# EAGLE design main_board (EAGLE 9.6.2)
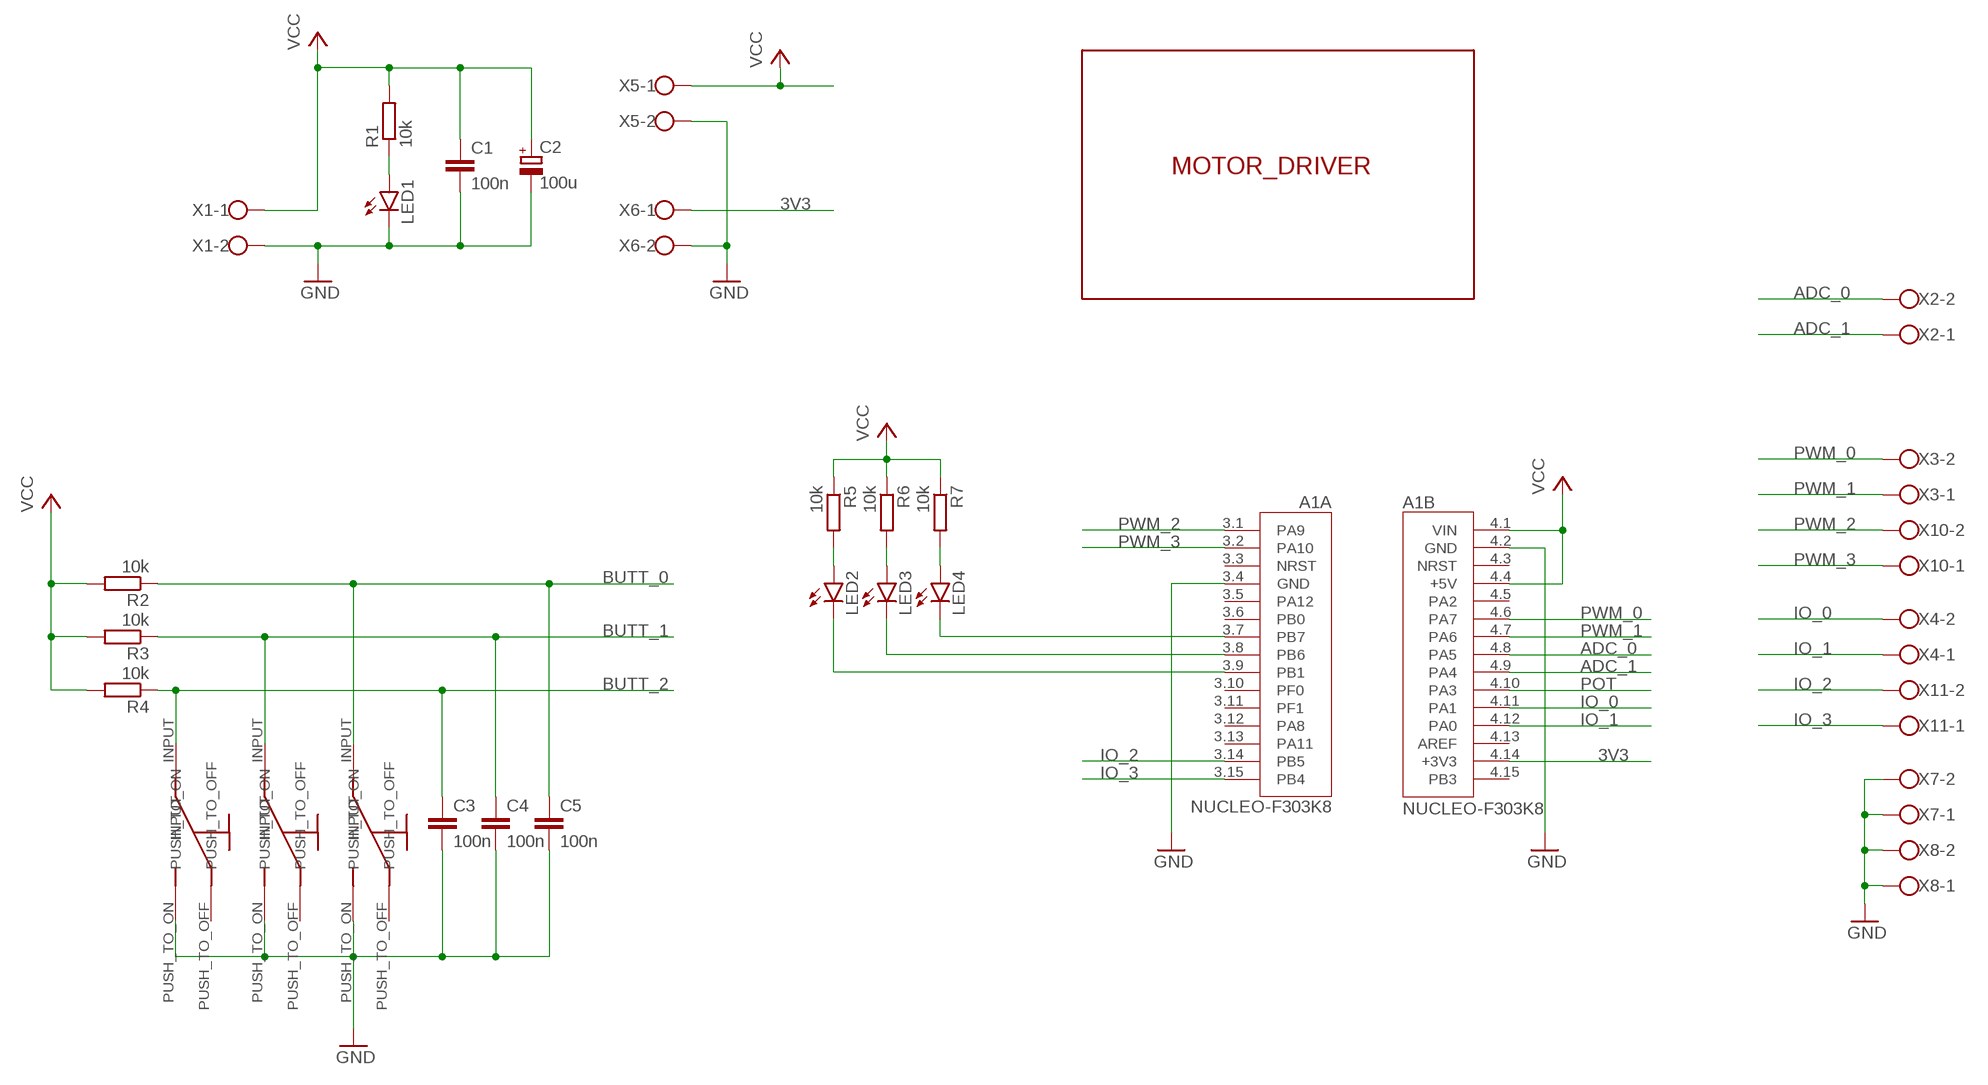
[diagram p0: schematic, sheet 1]

## Parts
A1  NUCLEO-F303K8  [MODULE_NUCLEO-F303K8]
C1  100n  C-EUC1206  [C1206]
C2  100u  CPOL-EU150CLZ-1010  [150CLZ-1010]
C3  100n  C-EUC1206  [C1206]
C4  100n  C-EUC1206  [C1206]
C5  100n  C-EUC1206  [C1206]
LED1  LEDSMT1206  [1206]
LED2  LEDCHIPLED_1206  [CHIPLED_1206]
LED3  LEDCHIPLED_1206  [CHIPLED_1206]
LED4  LEDCHIPLED_1206  [CHIPLED_1206]
R1  10k  R-EU_R1206  [R1206]
R2  10k  R-EU_R1206  [R1206]
R3  10k  R-EU_R1206  [R1206]
R4  10k  R-EU_R1206  [R1206]
R5  10k  R-EU_R1206  [R1206]
R6  10k  R-EU_R1206  [R1206]
R7  10k  R-EU_R1206  [R1206]
U$2  BUTTON  [BUTTON]
U$3  BUTTON  [BUTTON]
U$4  BUTTON  [BUTTON]
U$5  MOTOR_DRIVER  [MOTOR_DRIVER]
X1  W237-102  [W237-102]
X2  W237-102  [W237-102]
X3  W237-102  [W237-102]
X4  W237-102  [W237-102]
X5  W237-102  [W237-102]
X6  W237-102  [W237-102]
X7  W237-102  [W237-102]
X8  W237-102  [W237-102]
X10  W237-102  [W237-102]
X11  W237-102  [W237-102]

## Nets
3V3: A1.4.14(B:+3V3) X6.1
ADC_0: A1.4.8(B:PA5) X2.2
ADC_1: A1.4.9(B:PA4) X2.1
BUTT_0: C5.1 R2.1 U$4.INPUT
BUTT_1: C4.1 R3.1 U$2.INPUT
BUTT_2: C3.1 R4.1 U$3.INPUT
GND: A1.3.4(A:GND) A1.4.2(B:GND) C1.2 C2.- C3.2 C4.2 C5.2 LED1.C U$2.PUSH_TO_ON U$3.PUSH_TO_ON U$4.PUSH_TO_ON X1.2 X5.2 X6.2 X7.1 X7.2 X8.1 X8.2
IO_0: A1.4.11(B:PA1) X4.2
IO_1: A1.4.12(B:PA0) X4.1
IO_2: A1.3.14(A:PB5) X11.2
IO_3: A1.3.15(A:PB4) X11.1
N$2: A1.3.9(A:PB1) LED2.C
N$3: A1.3.8(A:PB6) LED3.C
N$4: A1.3.7(A:PB7) LED4.C
N$8: LED1.A R1.1
N$11: LED4.A R7.2
N$12: LED3.A R6.2
N$13: LED2.A R5.2
POT: A1.4.10(B:PA3)
PWM_0: A1.4.6(B:PA7) X3.2
PWM_1: A1.4.7(B:PA6) X3.1
PWM_2: A1.3.1(A:PA9) X10.2
PWM_3: A1.3.2(A:PA10) X10.1
VCC: A1.4.1(B:VIN) A1.4.4(B:+5V) C1.1 C2.+ R1.2 R2.2 R3.2 R4.2 R5.1 R6.1 R7.1 X1.1 X5.1
Unconnected: A1.3.3(A:NRST) A1.3.5(A:PA12) A1.3.6(A:PB0) A1.3.10(A:PF0) A1.3.11(A:PF1) A1.3.12(A:PA8) A1.3.13(A:PA11) A1.4.3(B:NRST) A1.4.5(B:PA2) A1.4.13(B:AREF) A1.4.15(B:PB3) U$2.PUSH_TO_OFF U$3.PUSH_TO_OFF U$4.PUSH_TO_OFF

## Library data of the parts
A1 = NUCLEO-F303K8:NUCLEO-F303K8: STM32 Nucleo-32 development board with STM32F303K8T6 MCU, supports Arduino connectivity; AVAILABILITY: Unavailable; DESCRIPTION: STM32F303K8, mbed-Enabled Development Nucleo-32 STM32F3 ARM® Cortex®-M4 MCU 32-Bit Embedded Evaluation Board; MF: STMicroelectronics; MP: NUCLEO-F303K8; PACKAGE: None; PRICE: None
C1 C3-C5 = rcl:C-EU: CAPACITOR, European symbol; SPICEPREFIX: C
C2 = rcl:CPOL-EU: POLARIZED CAPACITOR, European symbol; SPICEPREFIX: C
LED1-LED4 = led:LED: LED OSRAM: - CHIPLED LG R971, LG N971, LY N971, LG Q971, LY Q971, LO R971, LY R971 LH N974, LH R974 LS Q976, LO Q976, LY Q976 LO Q996 - Hyper CHIPLED LW Q18S LB Q993, LB Q99A, LB R99A - SideLED LS A670, LO A670, LY A670, LG A670, LP A670 LB A673, LV A673, LT A673, LW A673 LH A674 LY A675 LS A676, LA A676, LO A676, LY A676, LW A676 LS A679, LY A679, LG A679 - Hyper Micro SIDELED® LS Y876, LA Y876, LO Y876, LY Y876 LT Y87S - SmartLED LW L88C, LW L88S LB L89C, LB L89S, LG L890 LS L89K, LO L89K, LY L89K LS L896, LA L896, LO L896, LY L896 - TOPLED LS T670, LO T670, LY T670, LG T670, LP T670 LSG T670, LSP T670, LSY T670, LOP T670, LYG T670 LG T671, LOG T671, LSG T671 LB T673, LV T673, LT T673, LW T673 LH T674 LS T676, LA T676, LO T676, LY T676, LB T676, LH T676, LSB T676, LW T676 LB T67C, LV T67C, LT T67C, LS T67K, LO T67K, LY T67K, LW E67C LS E67B, LA E67B, LO E67B, LY E67B, LB E67C, LV E67C, LT E67C LW T67C LS T679, LY T679, LG T679 LS T770, LO T770, LY T770, LG T770, LP T770 LB T773, LV T773, LT T773, LW T773 LH T774 LS E675, LA E675, LY E675, LS T675 LS T776, LA T776, LO T776, LY T776, LB T776 LHGB T686 LT T68C, LB T68C - Hyper Mini TOPLED® LB M676 - Mini TOPLED Santana® LG M470 LS M47K, LO M47K, LY M47K Source: http://www.osram.convergy.de LUXEON: - LUMILED® LXK2-PW12-R00, LXK2-PW12-S00, LXK2-PW14-U00, LXK2-PW14-V00 LXK2-PM12-R00, LXK2-PM12-S00, LXK2-PM14-U00 LXK2-PE12-Q00, LXK2-PE12-R00, LXK2-PE12-S00, LXK2-PE14-T00, LXK2-PE14-U00 LXK2-PB12-K00, LXK2-PB12-L00, LXK2-PB12-M00, LXK2-PB14-N00, LXK2-PB14-P00, LXK2-PB14-Q00 LXK2-PR12-L00, LXK2-PR12-M00, LXK2-PR14-Q00, LXK2-PR14-R00 LXK2-PD12-Q00, LXK2-PD12-R00, LXK2-PD12-S00 LXK2-PH12-R00, LXK2-PH12-S00 LXK2-PL12-P00, LXK2-PL12-Q00, LXK2-PL12-R00 Source: www.luxeon.com KINGBRIGHT: KA-3528ASYC Source: www.kingbright.com
R1-R7 = rcl:R-EU_: RESISTOR, European symbol; SPICEPREFIX: R
U$2-U$4 = gramofon:BUTTON
U$5 = gramofon:MOTOR_DRIVER
X1-X8 X10 X11 = con-wago-500:W237-102: WAGO SCREW CLAMP; MPN: 237-102; OC_FARNELL: unknown; OC_NEWARK: 70K9898

## Board
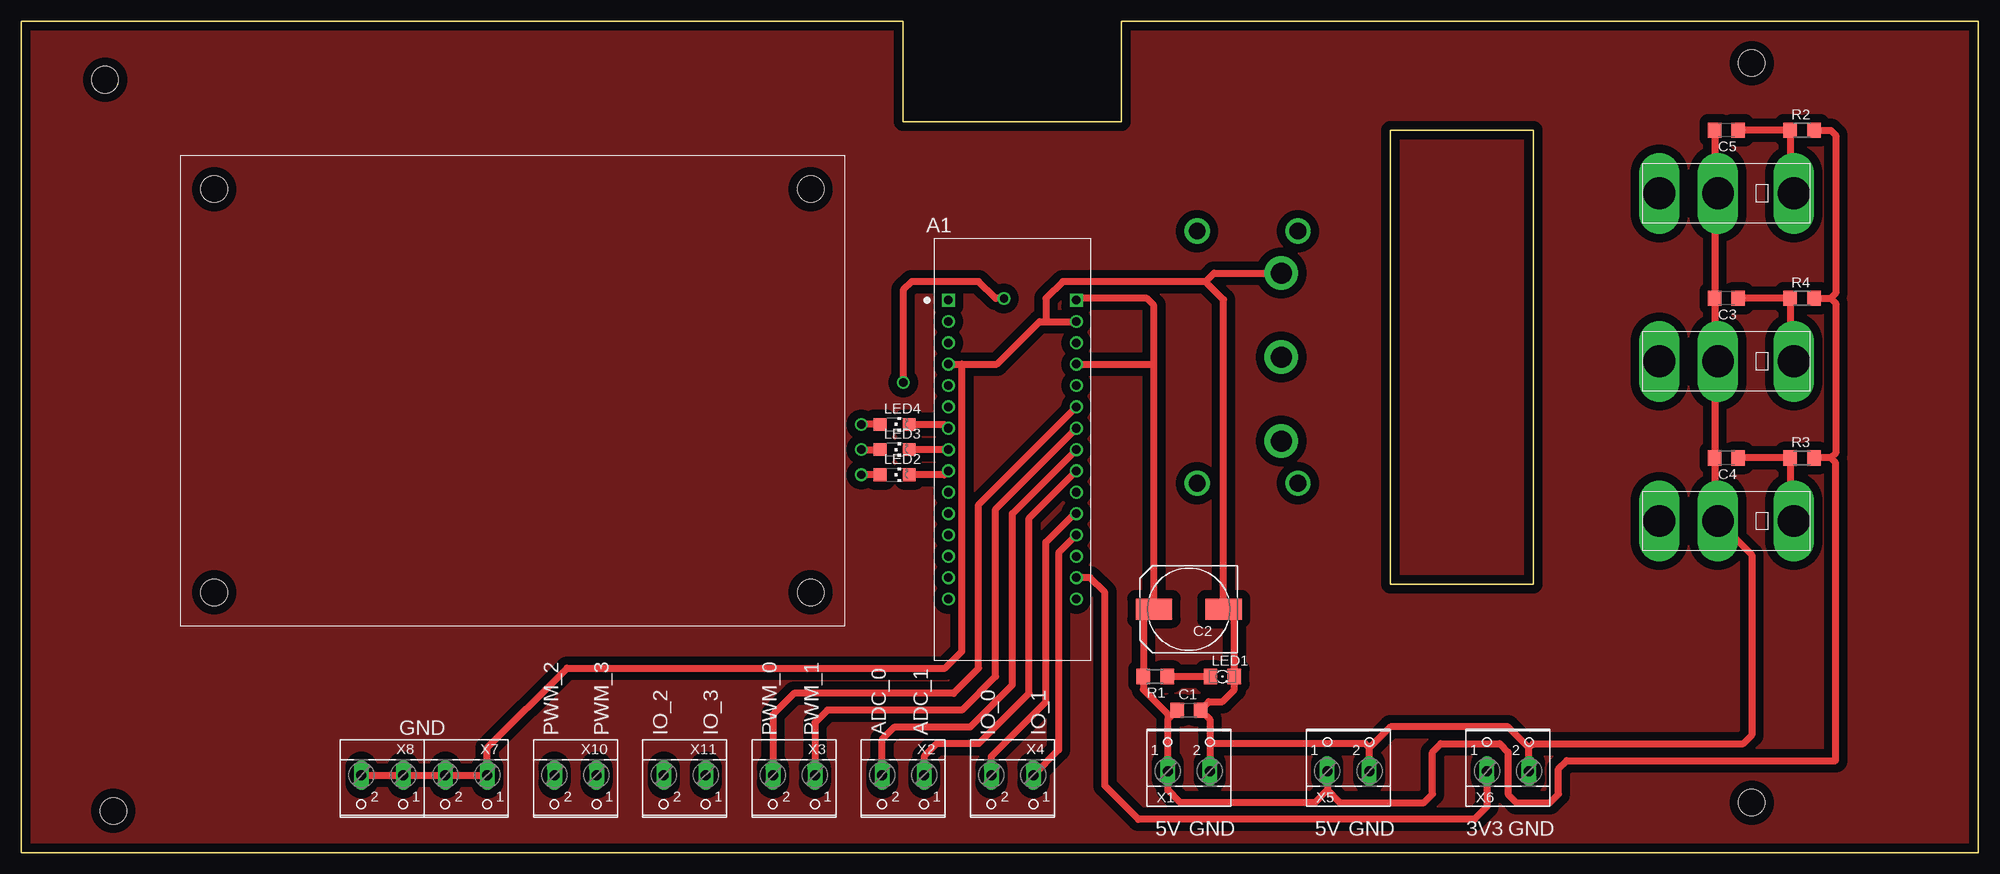
[diagram p1: board, top side]
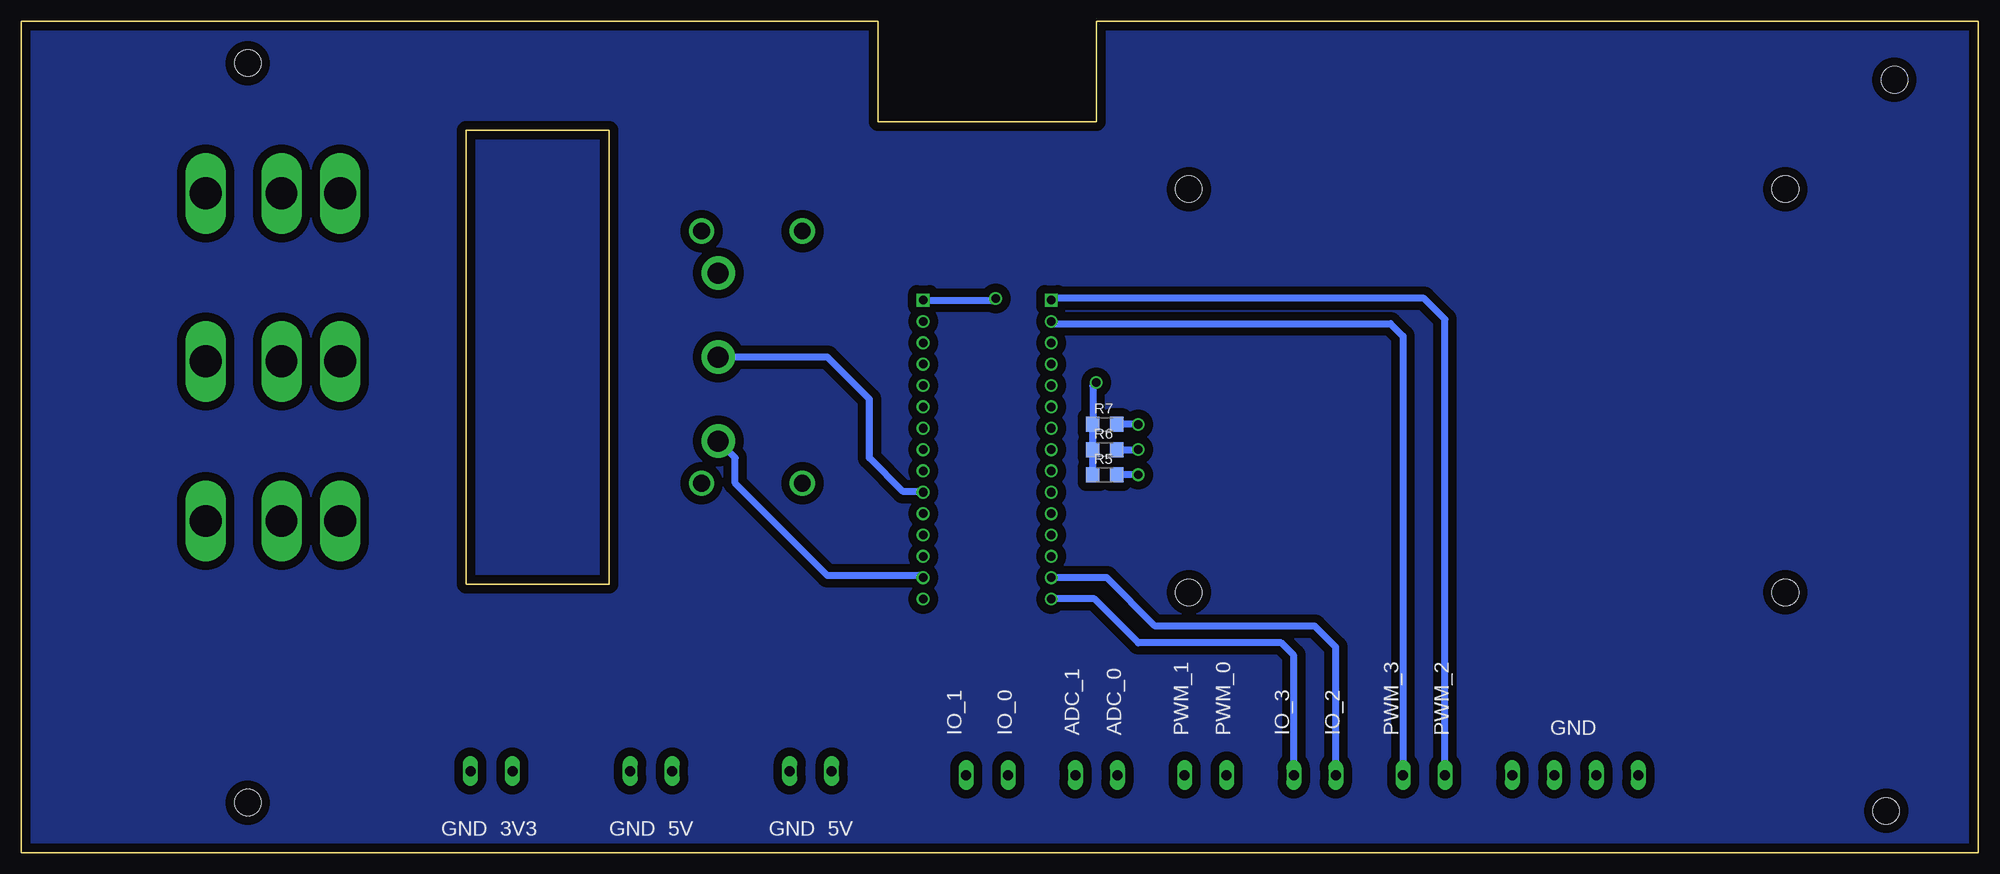
[diagram p2: board, bottom side, seen from below]

Size 233 x 99 mm. Coordinates in mm from the lower left corner, seen from the top.
Outline: 0,0 233,0 233,99 131,99 131,87 105,87 105,99 0,99 0,0
Outline: 180,86 180,32 163,32 163,86 180,86
Copper layers (1*16): Top 0.035mm / dielectric 1.5mm / Bottom 0.035mm
Design rules "default": minimum track width 6mil, minimum drill 0.35mm, track to track 6mil, track to pad 6mil, pad to pad 6mil, via to via 6mil, smd to smd 6mil, copper to edge 40mil, drill to drill 6mil, minimum pad ring 10mil, minimum via ring 8mil, stop-mask expansion 4mil, vias tented up to drill 0mil, thermal gap 10mil
Holes 3.2 mm at 206,94 206,6 11,5 10,92

### Footprints (pad centres in the part's own frame; a part is rotated, then mirrored left to right if it is on the bottom)
MODULE_NUCLEO-F303K8 = drill 1.02 square: 3.1 -7.62,17.78; 4.1 7.62,17.78 | drill 1.02: 3.2 -7.62,15.24; 3.3 -7.62,12.7; 3.4 -7.62,10.16; 3.5 -7.62,7.62; 3.6 -7.62,5.08; 3.7 -7.62,2.54; 3.8 -7.62,0; 3.9 -7.62,-2.54; 3.10 -7.62,-5.08; 3.11 -7.62,-7.62; 3.12 -7.62,-10.16; 3.13 -7.62,-12.7; 3.14 -7.62,-15.24; 3.15 -7.62,-17.78; 4.2 7.62,15.24; 4.3 7.62,12.7; 4.4 7.62,10.16; 4.5 7.62,7.62; 4.6 7.62,5.08; 4.7 7.62,2.54; 4.8 7.62,0; 4.9 7.62,-2.54; 4.10 7.62,-5.08; 4.11 7.62,-7.62; 4.12 7.62,-10.16; 4.13 7.62,-12.7; 4.14 7.62,-15.24; 4.15 7.62,-17.78
C1206 = smd 1.6 x 1.8: 1 -1.4,0; 2 1.4,0
150CLZ-1010 = smd 4.3 x 2.5: + 4.15,0; - -4.15,0
1206 = smd 1.6 x 1.803: A -1.422,0; C 1.422,0
CHIPLED_1206 = smd 1.5 x 1.5: A 0,-1.75; C 0,1.75
R1206 = smd 1.6 x 1.803: 1 -1.422,0; 2 1.422,0
BUTTON = drill 3.8 long: INPUT 3.5,18; PUSH_TO_OFF 3.5,2; PUSH_TO_ON 3.5,9
MOTOR_DRIVER = hole 3.2: 4,4; 52,4; 52,75; 4,75
W237-102 = drill 1.194 long: 1 -2.5,-1.27; 2 2.5,-1.27

### Placement (x,y rotation side)
A1  118,48 0 top
C1  139,17 0 top
C2  139,29 180 top
C3  203,66 180 top
C4  203,47 180 top
C5  203,86 180 top
LED1  143,21 0 top
LED2  104,45 270 top
LED3  104,48 270 top
LED4  104,51 270 top
R1  135,21 180 top
R2  212,86 0 top
R3  212,47 0 top
R4  212,66 0 top
R5  104,45 0 bottom
R6  104,48 0 bottom
R7  104,51 0 bottom
U$2  193,43 270 top
U$3  193,62 270 top
U$4  193,82 270 top
U$5  98,27 90 top
X1  139,11 0 top
X2  105,8 180 top
X3  92,8 180 top
X4  118,8 180 top
X5  158,11 0 top
X6  177,11 0 top
X7  53,8 180 top
X8  43,8 180 top
X10  66,8 180 top
X11  79,8 180 top

### Tracks (layer width: path | path; a pad name or v marks a point on that pad's centre or on a via)
3V3  (via drill 2.5 pad 4)
  Top 0.813: X6.1 174.5,5.5 173,4 133,4 129,8 129,31 127.24,32.76 A1.4.14
  Bottom 0.813: A1.4.14 125.86,33 137,33 148,44 148,47 v150,49
ADC_0
  Top 0.813: A1.4.8 118,40.38 118,20 113,15 104,15 102.5,13.5 X2.2
ADC_1
  Top 0.813: A1.4.9 120,39.84 120,19 114,13 109,13 107.5,11.5 X2.1
BUTT_0
  Top 0.813: C5.1 R2.1 210.58,78.92 U$4.INPUT
BUTT_1
  Top 0.813: C4.1 R3.1 210.58,39.92 U$2.INPUT
BUTT_2
  Top 0.813: C3.1 R4.1 210.58,58.92 U$3.INPUT
GND  (via drill 2.5 pad 4)
  Top 0.813: 141.5,13 141.5,15.9 C1.2 141.4,18 143,18 144.42,19.42 LED1.C 144.42,27.73 C2.- 143.15,65.85 141,68 | 141.5,13 X1.2 | X5.2 160.5,12.5 | 160.5,12.5 160,13 141.5,13 | X6.2 179.5,12.5 | 179.5,12.5 177,15 163,15 160.5,12.5 | C5.2 201.6,78.9 U$4.PUSH_TO_ON 201.6,78.1 C3.2 201.6,58.9 U$3.PUSH_TO_ON 201.6,58.1 C4.2 201.6,39.9 U$2.PUSH_TO_ON 206,35.5 206,14 205,13 180,13 179.5,12.5 | A1.3.4 112,58.16 | 112,58.16 116.16,58.16 121.24,63.24 122,63.24 | 122,63.24 A1.4.2 | 141,68 124,68 122,66 122,63.24 | X8.2 X8.1 X7.2 X7.1 55.5,12.5 65,22 110,22 112,24 112,58.16 | 141,68 142,69 v150,69
IO_0
  Top 0.813: X4.2 115.5,11.5 122,18 122,37 125.38,40.38 A1.4.11
IO_1
  Top 0.813: X4.1 123.5,12.27 123.5,35.72 A1.4.12
IO_2
  Bottom 0.813: X11.2 76.5,24.5 79,27 98,27 103.76,32.76 A1.3.14
IO_3
  Bottom 0.813: X11.1 81.5,23.5 83,25 100,25 105.22,30.22 A1.3.15
N$1  (via drill 2)
  other vias: 152,74
N$2
  Top 0.813: A1.3.9 109.92,45 LED2.C
N$3
  Top 0.813: A1.3.8 LED3.C
N$4
  Top 0.813: LED4.C 109.92,51 A1.3.7
N$5  (via drill 2)
  other vias: 152,44
N$6  (via drill 2)
  other vias: 140,44
N$7  (via drill 2)
  other vias: 140,74
N$8
  Top 0.813: R1.1 LED1.A
N$9
  pour Top (isolate 1): 0,0 0,99 104,99 105,100 105,87 131,87 131,99 233,99 233,0
N$10
  pour Bottom (isolate 1): 0,0 0,99 105,99 105,87 131,87 131,99 233,99 233,0
N$11  (via drill 1)
  Top 0.813: LED4.A v100,51
  Bottom 0.813: v100,51 R7.2
N$12  (via drill 1)
  Top 0.813: v100,48 LED3.A
  Bottom 0.813: R6.2 v100,48
N$13  (via drill 1)
  Top 0.813: LED2.A v100,45
  Bottom 0.813: v100,45 R5.2
POT  (via drill 2.5 pad 4)
  Bottom 0.813: A1.4.10 125.7,43 128,43 132,47 132,54 137,59 v150,59
PWM_0
  Top 0.813: A1.4.6 114,41.46 114,22 111,19 92,19 89.5,16.5 X3.2
PWM_1
  Top 0.813: A1.4.7 116,40.92 116,21 112,17 96,17 94.5,15.5 X3.1
PWM_2
  Bottom 0.813: X10.2 63.5,63.5 66,66 110.16,66 A1.3.1
PWM_3
  Bottom 0.813: A1.3.2 110.14,63 70,63 68.5,61.5 X10.1
VCC  (via drill 1)
  Top 0.813: 136.5,15.9 X1.1 136.5,7.5 138,6 154,6 155.5,7.5 | 136.5,15.9 C1.1 | 136.5,15.9 136.5,16.5 133.58,19.42 R1.2 133.58,27.73 C2.+ 134.85,58 | X5.1 155.5,7.5 | 215.42,66 216,65.42 216,47.58 215.42,47 | R4.2 215.42,66 | 215.42,47 R3.2 | R2.2 215.42,86 216,85.42 216,66.58 215.42,66 | 134.85,58 134.85,65.15 134,66 125.84,66 A1.4.1 | A1.4.4 134.69,58.16 134.85,58 | 155.5,7.5 157,6 167,6 168,7 168,12 169,13 176,13 177,12 177,7 178,6 182,6 183,7 183,10 184,11 216,11 216,46.42 215.42,47 | v117,66 116,66 114,68 106,68 105,67 v105,56
  Bottom 0.813: R5.1 R6.1 R7.1 105.42,55.58 v105,56 | A1.4.1 117.22,65.78 v117,66

### Text on the board
tPlace: GND
bPlace: GND
tNames: PWM_2 | PWM_3 | IO_2 | IO_3 | PWM_0 | PWM_1 | ADC_0 | ADC_1 | IO_0 | IO_1 | 5V | GND | 5V | GND | 3V3 | GND
bNames: PWM_2 | PWM_3 | IO_2 | IO_3 | PWM_0 | PWM_1 | ADC_0 | ADC_1 | IO_0 | IO_1 | 5V | GND | 5V | GND | 3V3 | GND